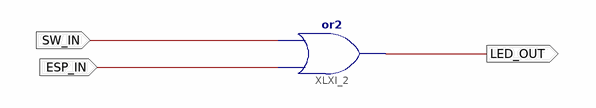
[diagram p0: schematic sheet 1]
// Xilinx ISE schematic Regular_LED_V3.sch (spartan6) as structural Verilog: 1 symbols, 3 ports
module Regular_LED_V3 (
  input  SW_IN,
  input  ESP_IN,
  output LED_OUT
);

  or XLXI_2 (LED_OUT, ESP_IN, SW_IN);
endmodule
